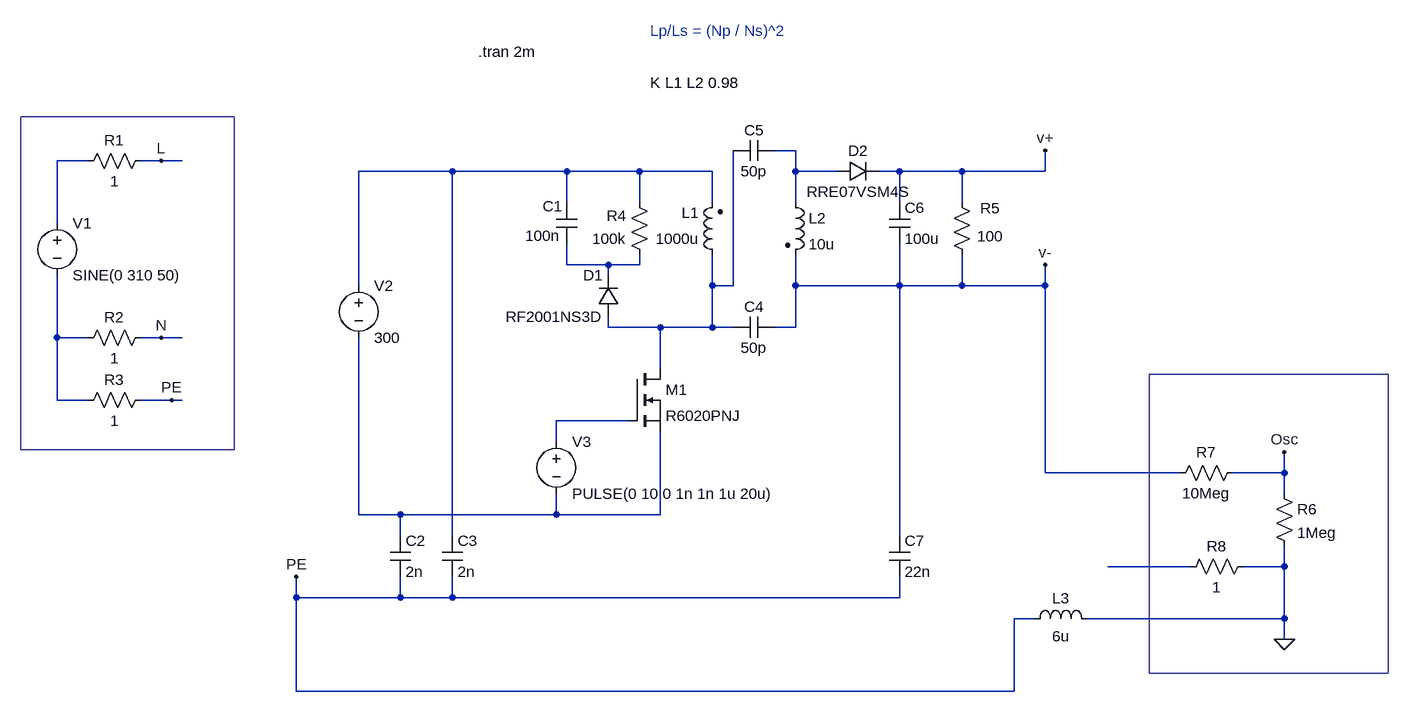
[diagram p0: schematic Draft20.asc]
Draft20.asc, the LTspice schematic file:
Version 4
SHEET 1 1748 996
WIRE 832 112 800 112
WIRE -256 128 -304 128
WIRE -144 128 -176 128
WIRE -112 128 -144 128
WIRE 304 144 160 144
WIRE 480 144 304 144
WIRE 592 144 480 144
WIRE 704 144 592 144
WIRE 832 144 832 112
WIRE 896 144 832 144
WIRE 992 144 960 144
WIRE 1088 144 992 144
WIRE 1216 144 1216 112
WIRE 1216 144 1088 144
WIRE 480 192 480 144
WIRE 592 192 592 144
WIRE 704 192 704 144
WIRE 832 192 832 144
WIRE 992 192 992 144
WIRE 1088 192 1088 144
WIRE -304 224 -304 128
WIRE 480 288 480 256
WIRE 544 288 480 288
WIRE 592 288 592 272
WIRE 592 288 544 288
WIRE 544 304 544 288
WIRE 160 320 160 144
WIRE 704 320 704 272
WIRE 736 320 736 112
WIRE 736 320 704 320
WIRE 832 320 832 272
WIRE 992 320 992 256
WIRE 992 320 832 320
WIRE 1088 320 1088 272
WIRE 1088 320 992 320
WIRE 1216 320 1216 288
WIRE 1216 320 1088 320
WIRE 544 384 544 368
WIRE 624 384 544 384
WIRE 704 384 704 320
WIRE 704 384 624 384
WIRE 736 384 704 384
WIRE 832 384 832 320
WIRE 832 384 800 384
WIRE -304 400 -304 304
WIRE -256 400 -304 400
WIRE -144 400 -176 400
WIRE -112 400 -144 400
WIRE 624 448 624 384
WIRE -304 496 -304 400
WIRE -256 496 -304 496
WIRE -128 496 -176 496
WIRE -112 496 -128 496
WIRE 576 528 464 528
WIRE 464 560 464 528
WIRE 1216 608 1216 320
WIRE 1424 608 1216 608
WIRE 1584 608 1584 576
WIRE 1584 608 1504 608
WIRE 1584 640 1584 608
WIRE 160 672 160 400
WIRE 224 672 160 672
WIRE 464 672 464 640
WIRE 464 672 224 672
WIRE 624 672 624 544
WIRE 624 672 464 672
WIRE 224 704 224 672
WIRE 304 704 304 144
WIRE 992 704 992 320
WIRE 1440 752 1312 752
WIRE 1584 752 1584 720
WIRE 1584 752 1520 752
WIRE 64 800 64 768
WIRE 224 800 224 768
WIRE 224 800 64 800
WIRE 304 800 304 768
WIRE 304 800 224 800
WIRE 992 800 992 768
WIRE 992 800 304 800
WIRE 1200 832 1168 832
WIRE 1584 832 1584 752
WIRE 1584 832 1280 832
WIRE 1584 864 1584 832
WIRE 64 944 64 800
WIRE 1168 944 1168 832
WIRE 1168 944 64 944
FLAG -144 128 L
FLAG -144 400 N
FLAG -128 496 PE
FLAG 1216 112 v+
FLAG 1216 288 v-
FLAG 64 768 PE
FLAG 1584 864 0
FLAG 1584 576 Osc
SYMBOL voltage -304 208 R0
SYMATTR InstName V1
SYMATTR Value SINE(0 310 50)
SYMBOL voltage 160 304 R0
SYMATTR InstName V2
SYMATTR Value 300
SYMBOL voltage 464 544 R0
SYMATTR InstName V3
SYMATTR Value PULSE(0 10 0 1n 1n 1u 20u)
SYMBOL res -160 112 R90
WINDOW 0 0 56 VBottom 2
WINDOW 3 32 56 VTop 2
SYMATTR InstName R1
SYMATTR Value 1
SYMBOL res -160 384 R90
WINDOW 0 0 56 VBottom 2
WINDOW 3 32 56 VTop 2
SYMATTR InstName R2
SYMATTR Value 1
SYMBOL res -160 480 R90
WINDOW 0 0 56 VBottom 2
WINDOW 3 32 56 VTop 2
SYMATTR InstName R3
SYMATTR Value 1
SYMBOL res 608 288 R180
WINDOW 0 36 76 Left 2
WINDOW 3 36 40 Left 2
SYMATTR InstName R4
SYMATTR Value 100k
SYMBOL res 1104 288 R180
WINDOW 0 -43 87 Left 2
WINDOW 3 -48 44 Left 2
SYMATTR InstName R5
SYMATTR Value 100
SYMBOL diode 560 368 R180
WINDOW 0 24 64 Left 2
WINDOW 3 24 0 Left 2
SYMATTR InstName D1
SYMATTR Value RF2001NS3D
SYMBOL diode 896 160 R270
WINDOW 0 32 32 VTop 2
WINDOW 3 0 32 VBottom 2
SYMATTR InstName D2
SYMATTR Value RRE07VSM4S
SYMBOL ind2 720 288 R180
WINDOW 0 36 80 Left 2
WINDOW 3 36 40 Left 2
SYMATTR InstName L1
SYMATTR Value 1000u
SYMATTR Type ind
SYMBOL ind2 816 176 R0
SYMATTR InstName L2
SYMATTR Value 10u
SYMATTR Type ind
SYMBOL cap 464 192 R0
WINDOW 0 -21 6 Left 2
WINDOW 3 -48 51 Left 2
SYMATTR InstName C1
SYMATTR Value 100n
SYMBOL nmos 576 448 R0
SYMATTR InstName M1
SYMATTR Value R6020PNJ
SYMBOL cap 208 704 R0
SYMATTR InstName C2
SYMATTR Value 2n
SYMBOL cap 288 704 R0
SYMATTR InstName C3
SYMATTR Value 2n
SYMBOL cap 800 368 R90
WINDOW 0 0 32 VBottom 2
WINDOW 3 32 32 VTop 2
SYMATTR InstName C4
SYMATTR Value 50p
SYMBOL cap 800 96 R90
WINDOW 0 0 32 VBottom 2
WINDOW 3 32 32 VTop 2
SYMATTR InstName C5
SYMATTR Value 50p
SYMBOL cap 976 192 R0
SYMATTR InstName C6
SYMATTR Value 100u
SYMBOL cap 976 704 R0
SYMATTR InstName C7
SYMATTR Value 22n
SYMBOL res 1568 624 R0
SYMATTR InstName R6
SYMATTR Value 1Meg
SYMBOL res 1520 592 R90
WINDOW 0 0 56 VBottom 2
WINDOW 3 32 56 VTop 2
SYMATTR InstName R7
SYMATTR Value 10Meg
SYMBOL ind 1296 848 M270
WINDOW 0 32 56 VTop 2
WINDOW 3 4 56 VBottom 2
SYMATTR InstName L3
SYMATTR Value 6u
SYMBOL res 1536 736 R90
WINDOW 0 0 56 VBottom 2
WINDOW 3 32 56 VTop 2
SYMATTR InstName R8
SYMATTR Value 1
TEXT 608 8 Left 2 !K L1 L2 0.98
TEXT 344 -40 Left 2 !.tran 2m
TEXT 608 -72 Left 2 ;Lp/Ls = (Np / Ns)^2
RECTANGLE Normal -32 572 -360 60
RECTANGLE Normal 1744 916 1376 456

The netlist it stands for:
* Draft20.asc
V1 N002 N006 SINE(0 310 50)
V2 N003 N008 300
V3 N007 N008 PULSE(0 10 0 1n 1n 1u 20u)
R1 L N002 1
R2 N N006 1
R3 PE N006 1
R4 N004 N003 100k
R5 v- v+ 100
D1 N005 N004 RF2001NS3D
D2 N001 v+ RRE07VSM4S
L1 N005 N003 1000u
L2 N001 v- 10u
C1 N003 N004 100n
M1 N005 N007 N008 N008 R6020PNJ
C2 N008 PE 2n
C3 N003 PE 2n
C4 v- N005 50p
C5 N001 N005 50p
C6 v+ v- 100u
C7 v- PE 22n
R6 Osc 0 1Meg
R7 Osc v- 10Meg
L3 0 PE 6u
R8 0 N009 1
.model D D
.lib standard.dio
.model NMOS NMOS
.model PMOS PMOS
.lib standard.mos
K L1 L2 0.98
.tran 2m
* Lp/Ls = (Np / Ns)^2
.backanno
.end